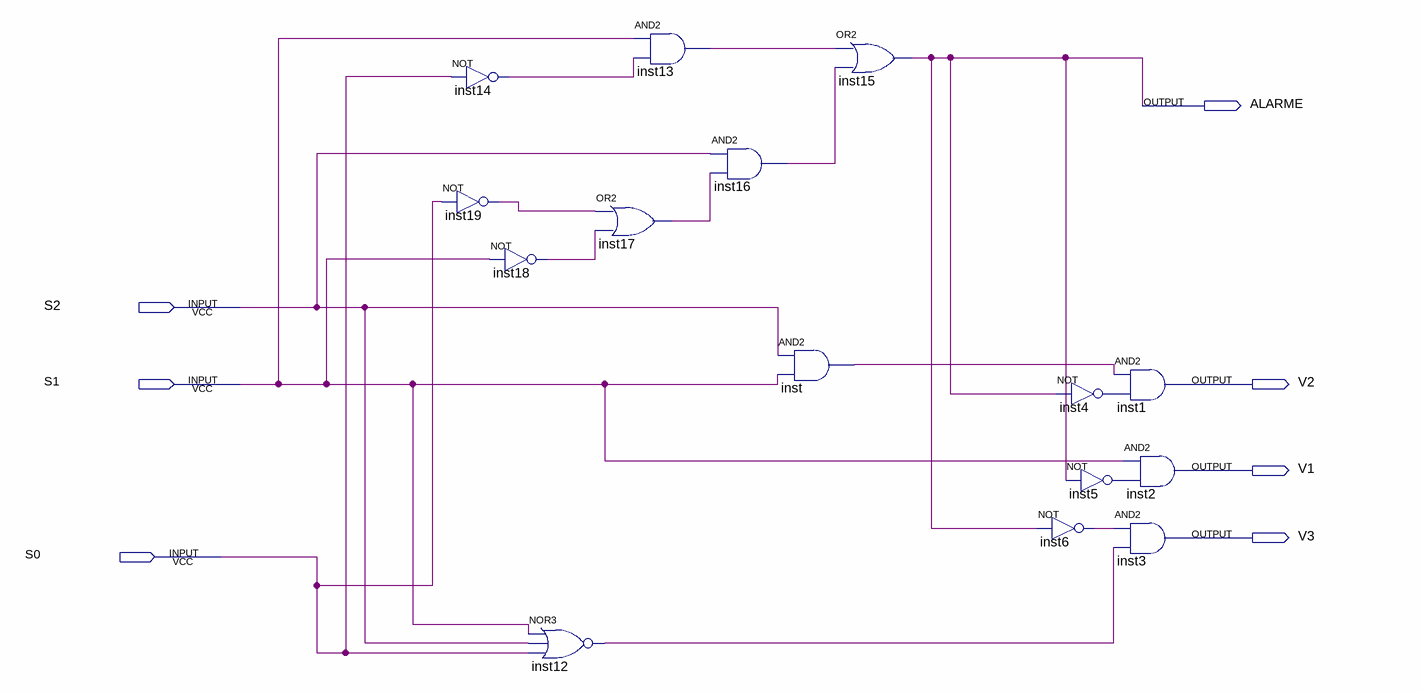
[diagram p0: schematic sheet]
// Quartus schematic Aula2.bdf as structural Verilog: 15 symbols, 7 pins
module Aula2 (
  input  S2,
  input  S1,
  input  S0,
  output ALARME,
  output V2,
  output V1,
  output V3
);

  wire inst4_out, inst5_out, inst6_out, inst12_out, inst13_out, inst14_out, inst16_out, inst17_out,
       inst18_out, inst19_out, inst_out;

  not inst14 (inst14_out, S0);
  not inst19 (inst19_out, S0);
  not inst18 (inst18_out, S1);
  nor inst12 (inst12_out, S1, S2, S0);
  or inst17 (inst17_out, inst19_out, inst18_out);
  and inst13 (inst13_out, S1, inst14_out);
  and inst16 (inst16_out, S2, inst17_out);
  and inst (inst_out, S2, S1);
  or inst15 (ALARME, inst13_out, inst16_out);
  not inst4 (inst4_out, ALARME);
  not inst5 (inst5_out, ALARME);
  not inst6 (inst6_out, ALARME);
  and inst1 (V2, inst_out, inst4_out);
  // AND2 inst2 has open pins: IN1=S1, IN2=inst5_out, OUT=open
  and inst3 (V3, inst6_out, inst12_out);
endmodule
